# Altium schematic sheet 4nd design.SchDoc
size A
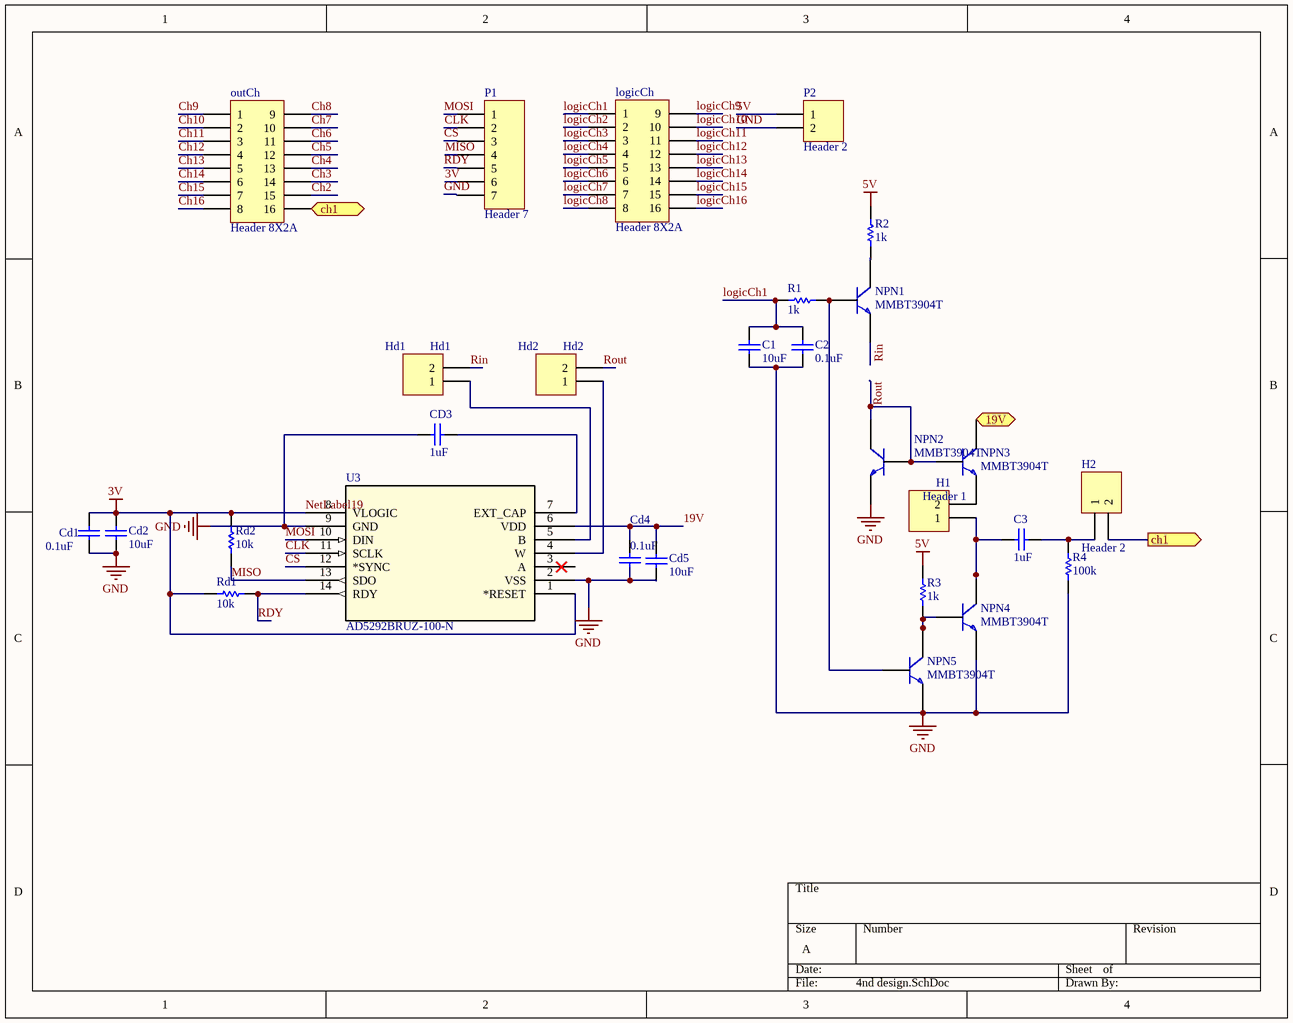
[diagram p0: 4nd design.SchDoc]

## Parts
C1  value 10uF  [CC2012-0805]  (hidden comment: Cap-NP)
C2  value 0.1uF  [CC2012-0805]  (hidden comment: Cap-NP)
C3  value 1uF  [CC2012-0805]  (hidden comment: Cap-NP)
Cd1  value 0.1uF  [CC2012-0805]  (hidden comment: Cap-NP)
Cd2  value 10uF  [CC2012-0805]  (hidden comment: Cap-NP)
CD3  value 1uF  [CC2012-0805]  (hidden comment: Cap-NP)
Cd4  value 0.1uF  [CC2012-0805]  (hidden comment: Cap-NP)
Cd5  value 10uF  [CC2012-0805]  (hidden comment: Cap-NP)
H1  Header 1  [HDR1X2]
H2  Header 2  [HDR1X2]
Hd1  Hd1  [HDR1X2]
Hd2  Hd2  [HDR1X2]
logicCh  Header 8X2A  [HDR2X8_CEN]
NPN1  MMBT3904T  [MMBT3904T]
NPN2  MMBT3904T  [MMBT3904T]
NPN3  MMBT3904T  [MMBT3904T]
NPN4  MMBT3904T  [MMBT3904T]
NPN5  MMBT3904T  [MMBT3904T]
outCh  Header 8X2A  [HDR2X8_CEN]
P1  Header 7  [HDR1X7]
P2  Header 2  [HDR1X2]
R1  value 1k  [CC2012-0805]  (hidden comment: Res)
R2  value 1k  [CC2012-0805]  (hidden comment: Res)
R3  value 1k  [CC2012-0805]  (hidden comment: Res)
R4  value 100k  [CC2012-0805]  (hidden comment: Res)
Rd1  value 10k  [CC2012-0805]  (hidden comment: Res)
Rd2  value 10k  [CC2012-0805]  (hidden comment: Res)
U3  AD5292BRUZ-100-N  [RU_14]

## Ports
19V (in), ch1 (out)

## Nets
3V: Cd1.1 Cd2.1 P1.6 Rd1.2 Rd2.1 U3.1(*RESET) U3.8(VLOGIC)  [also labelled NetLabel19]
5V: P2.1 R2.2 R3.2
GND: C1.2 C2.2 Cd1.2 Cd2.2 CD3.1 Cd4.1 Cd5.1 NPN2.3(E) NPN4.3(E) NPN5.3(E) P1.7 P2.2 R4.1 U3.2(VSS) U3.9(GND)
19V: NPN3.1(C) ; port 19V
19V: Cd4.2 Cd5.2 U3.6(VDD)  [a separate net that carries the same name]
ch1: H2.2 outCh.16 ; port ch1
Ch2: outCh.15
Ch3: outCh.14
Ch4: outCh.13
Ch5: outCh.12
Ch6: outCh.11
Ch7: outCh.10
Ch8: outCh.9
Ch9: outCh.1
Ch10: outCh.2
Ch11: outCh.3
Ch12: outCh.4
Ch13: outCh.5
Ch14: outCh.6
Ch15: outCh.7
Ch16: outCh.8
CLK: P1.2 U3.11(SCLK)
CS: P1.3 U3.12(*SYNC)
logicCh1: C1.1 C2.1 logicCh.1 R1.2
logicCh2: logicCh.2
logicCh3: logicCh.3
logicCh4: logicCh.4
logicCh5: logicCh.5
logicCh6: logicCh.6
logicCh7: logicCh.7
logicCh8: logicCh.8
logicCh9: logicCh.9
logicCh10: logicCh.10
logicCh11: logicCh.11
logicCh12: logicCh.12
logicCh13: logicCh.13
logicCh14: logicCh.14
logicCh15: logicCh.15
logicCh16: logicCh.16
MISO: P1.4 Rd2.2 U3.13(SDO)
MOSI: P1.1 U3.10(DIN)
RDY: P1.5 Rd1.1 U3.14(RDY)
Rin: Hd1.2 NPN1.3(E)
Rout: Hd2.2 NPN2.1(C) NPN2.2(B) NPN3.2(B)
NetC3_1: C3.1 H1.1 NPN4.1(C)
NetC3_2: C3.2 H2.1 R4.2
NetCD3_2: CD3.2 U3.7(EXT_CAP)
NetH1_2: H1.2 NPN3.3(E)
NetHd1_1: Hd1.1 U3.5(B)
NetHd2_1: Hd2.1 U3.4(W)
NetNPN1_1: NPN1.1(C) R2.1
NetNPN1_2: NPN1.2(B) NPN5.2(B) R1.1
NetNPN4_2: NPN4.2(B) NPN5.1(C) R3.1

Not connected (* = marked no-connect by the designer): U3 3(A)

## Library data of the parts
C1-C3 Cd1 Cd2 CD3 Cd4 Cd5 = Cap-NP: Capacitor; Manufacturer: Generic Components; Class I: Passive; Published: 8-Jun-2000; Revision: July-2002: Re-released for DXP Platform.; Publisher: Altium Limited; Class II: Capacitor
H1 H2 Hd1 Hd2 P2 = Header 2: Header, 2-Pin; LatestRevisionDate: 17-Jul-2002; LatestRevisionNote: Re-released for DXP Platform.; Publisher: Altium Limited
logicCh outCh = Header 8X2A: Header, 8-Pin, Dual row; LatestRevisionDate: 17-Jul-2002; LatestRevisionNote: Re-released for DXP Platform.; Publisher: Altium Limited
NPN1-NPN5 = Component_1
P1 = Header 7: Header, 7-Pin; LatestRevisionDate: 17-Jul-2002; LatestRevisionNote: Re-released for DXP Platform.; Publisher: Altium Limited
R1-R4 Rd1 Rd2 = Res: Resistor; Manufacturer: Generic Components; Class I: Passive; Published: 8-Jun-2000; Revision: July-2002: Re-released for DXP Platform.; Publisher: Altium Limited; Class II: Resistor
U3 = AD5292BRUZ-100-N: Imported; Manufacturer_Part_Number: AD5292BRUZ-100-ND; Vendor: Analog Devices Inc; Built_By: EMA_UL_Team; RefDes: RefDes; Type: DEV; Value: Value